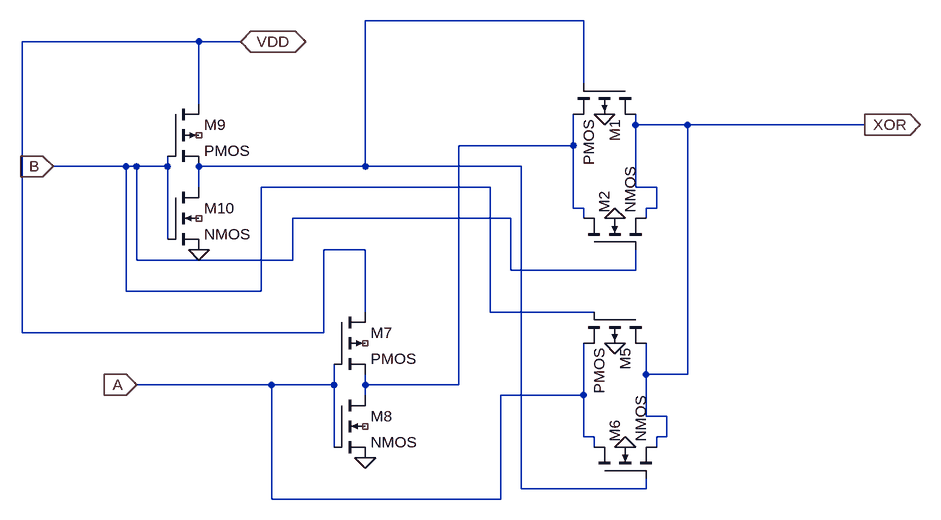
[diagram p0: schematic XOR_TG_VDD.asc]
XOR_TG_VDD.asc, the LTspice schematic file:
Version 4
SHEET 1 1028 772
WIRE 208 0 -128 0
WIRE -384 32 -656 32
WIRE -320 32 -384 32
WIRE 208 96 208 0
WIRE -384 128 -384 32
WIRE 288 160 288 144
WIRE 368 160 288 160
WIRE 640 160 368 160
WIRE 192 192 192 144
WIRE 192 192 16 192
WIRE -496 224 -608 224
WIRE -480 224 -496 224
WIRE -432 224 -432 208
WIRE -432 224 -480 224
WIRE -128 224 -128 0
WIRE -128 224 -384 224
WIRE 112 224 -128 224
WIRE -384 256 -384 224
WIRE 64 256 -288 256
WIRE 288 256 288 160
WIRE 320 256 288 256
WIRE 192 288 192 192
WIRE 208 288 192 288
WIRE 320 288 320 256
WIRE 320 288 304 288
WIRE 96 304 -240 304
WIRE 208 304 208 288
WIRE 304 304 304 288
WIRE -432 336 -432 224
WIRE -128 352 -192 352
WIRE -480 368 -480 224
WIRE -240 368 -240 304
WIRE -240 368 -480 368
WIRE 96 384 96 304
WIRE 288 384 288 352
WIRE 288 384 96 384
WIRE -496 416 -496 224
WIRE -288 416 -288 256
WIRE -288 416 -496 416
WIRE -128 448 -128 352
WIRE 64 448 64 256
WIRE 224 448 64 448
WIRE -656 480 -656 32
WIRE -192 480 -192 352
WIRE -192 480 -656 480
WIRE 304 544 304 496
WIRE 368 544 368 160
WIRE 368 544 304 544
WIRE -272 560 -480 560
WIRE -176 560 -176 528
WIRE -176 560 -272 560
WIRE -128 560 -128 544
WIRE 16 560 16 192
WIRE 16 560 -128 560
WIRE -128 576 -128 560
WIRE 208 576 208 496
WIRE 208 576 80 576
WIRE 304 608 304 544
WIRE 336 608 304 608
WIRE 208 640 208 576
WIRE 224 640 208 640
WIRE 336 640 336 608
WIRE 336 640 320 640
WIRE -176 656 -176 560
WIRE 224 656 224 640
WIRE 320 656 320 640
WIRE 112 720 112 224
WIRE 304 720 304 704
WIRE 304 720 112 720
WIRE -272 736 -272 560
WIRE 80 736 80 576
WIRE 80 736 -272 736
FLAG -480 560 A
IOPIN -480 560 In
FLAG 640 160 XOR
IOPIN 640 160 Out
FLAG 240 144 0
FLAG 256 304 0
FLAG 256 496 0
FLAG 272 656 0
FLAG -128 672 0
FLAG -384 352 0
FLAG -608 224 B
IOPIN -608 224 In
FLAG -320 32 VDD
IOPIN -320 32 BiDir
SYMBOL pmos4 288 96 R90
SYMATTR InstName M1
SYMBOL nmos4 208 352 R270
SYMATTR InstName M2
SYMBOL pmos4 304 448 R90
SYMATTR InstName M5
SYMBOL nmos4 224 704 R270
SYMATTR InstName M6
SYMBOL pmos4 -176 448 R0
SYMATTR InstName M7
SYMBOL nmos4 -176 576 R0
SYMATTR InstName M8
SYMBOL pmos4 -432 128 R0
SYMATTR InstName M9
SYMBOL nmos4 -432 256 R0
SYMATTR InstName M10

The netlist it stands for:
* XOR_TG_VDD.asc
M1 XOR N001 N002 0 PMOS
M2 N002 B XOR 0 NMOS
M5 XOR B A 0 PMOS
M6 A N001 XOR 0 NMOS
M7 VDD A N002 NC_01 PMOS
M8 N002 A 0 NC_02 NMOS
M9 VDD B N001 NC_03 PMOS
M10 N001 B 0 NC_04 NMOS
.model NMOS NMOS
.model PMOS PMOS
.lib standard.mos
.backanno
.end